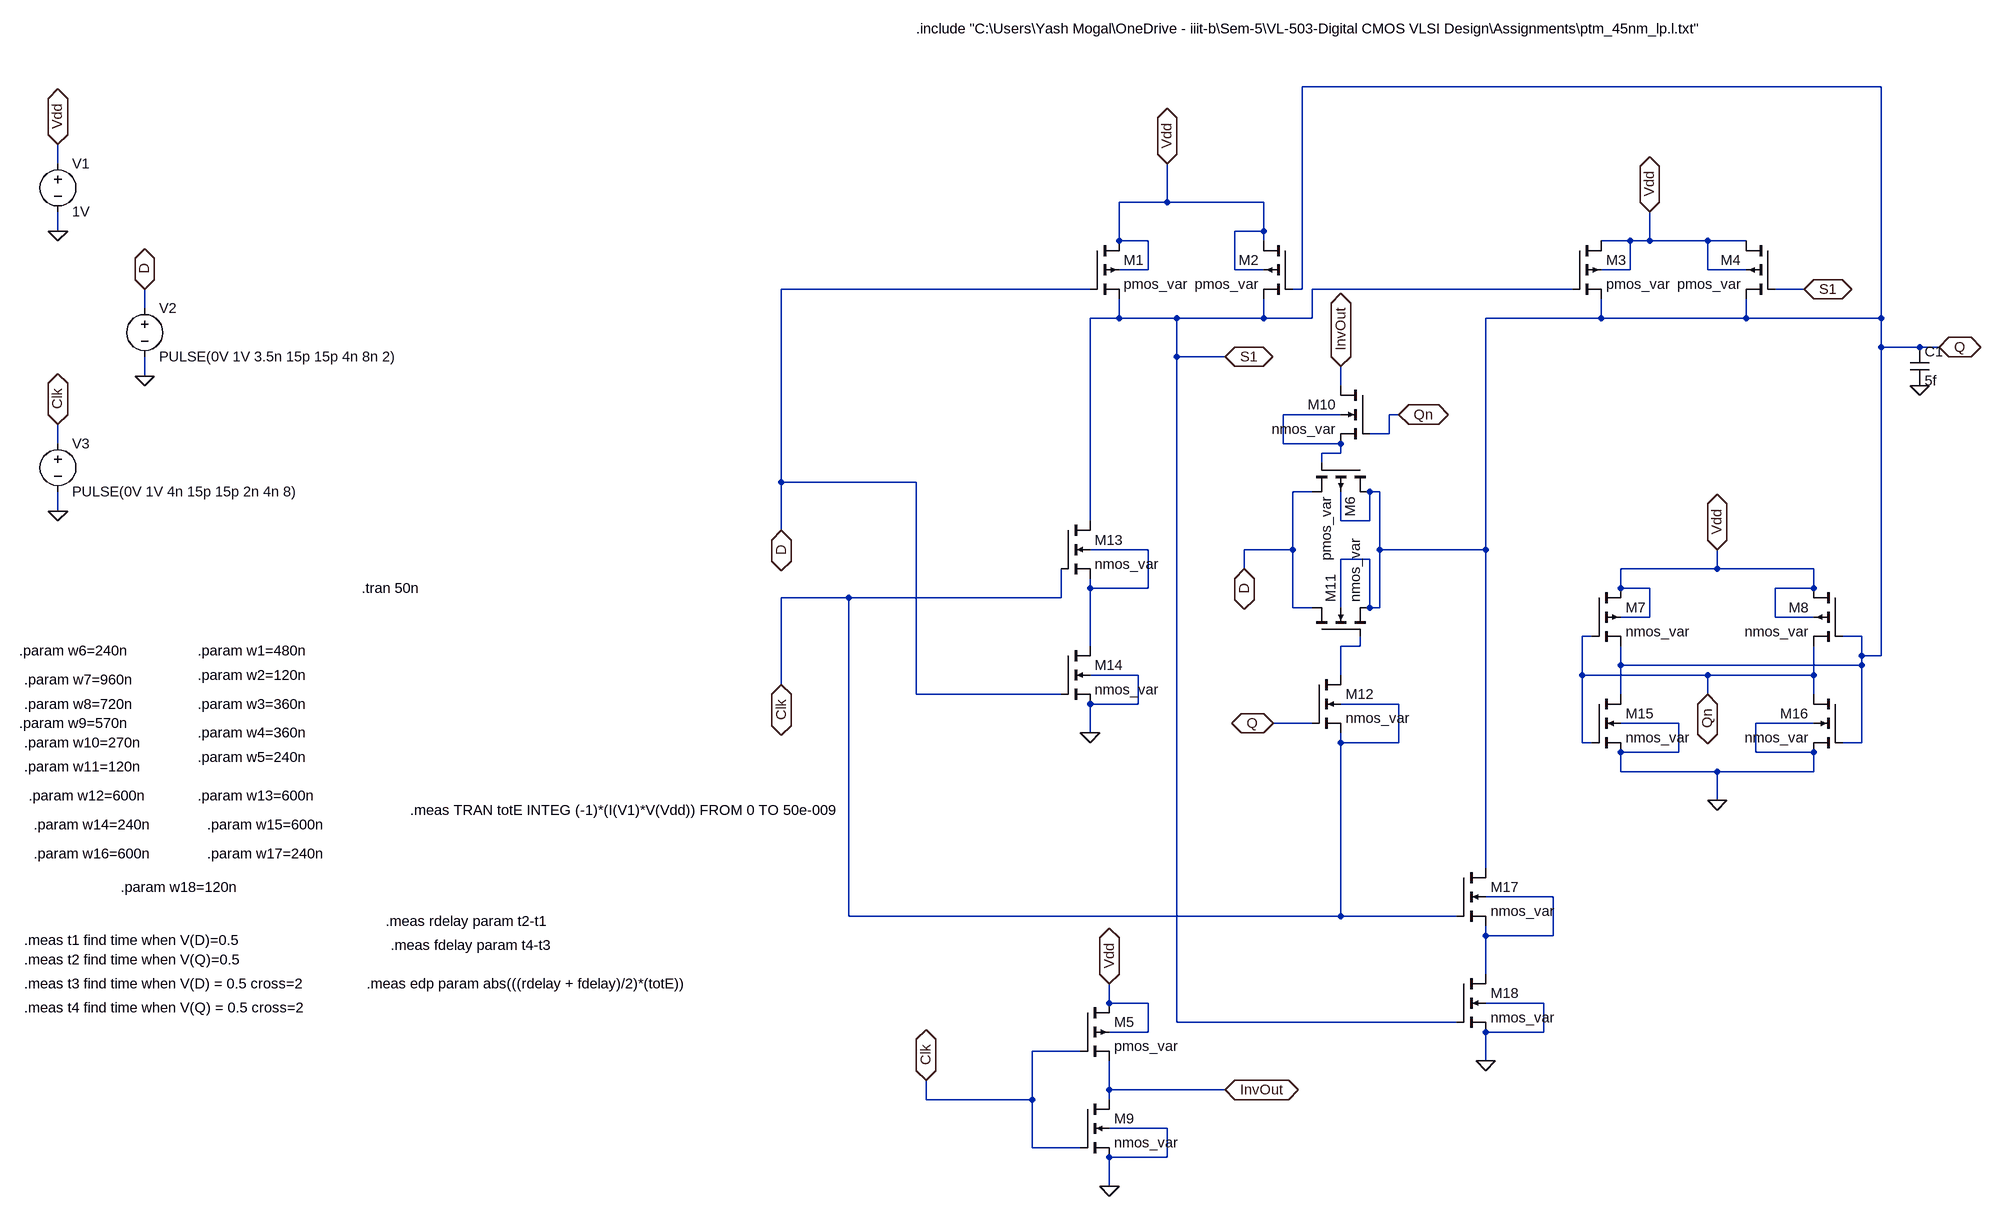
[diagram p0: schematic Proposed_ckt_new.asc]
Proposed_ckt_new.asc, the LTspice schematic file:
Version 4
SHEET 1 1552 1540
WIRE 1376 -304 416 -304
WIRE -1648 -176 -1648 -208
WIRE 192 -112 192 -176
WIRE 192 -112 112 -112
WIRE 352 -112 192 -112
WIRE -1648 -64 -1648 -96
WIRE 352 -64 352 -112
WIRE 352 -64 304 -64
WIRE 112 -48 112 -112
WIRE 160 -48 112 -48
WIRE 352 -48 352 -64
WIRE 960 -48 912 -48
WIRE 992 -48 992 -96
WIRE 992 -48 960 -48
WIRE 1088 -48 992 -48
WIRE 1152 -48 1088 -48
WIRE 160 0 160 -48
WIRE 160 0 112 0
WIRE 304 0 304 -64
WIRE 352 0 304 0
WIRE 960 0 960 -48
WIRE 960 0 912 0
WIRE 1088 0 1088 -48
WIRE 1152 0 1088 0
WIRE 64 32 -448 32
WIRE 416 32 416 -304
WIRE 416 32 400 32
WIRE 864 32 432 32
WIRE 1248 32 1200 32
WIRE -1504 64 -1504 32
WIRE 112 80 112 48
WIRE 112 80 64 80
WIRE 208 80 112 80
WIRE 352 80 352 48
WIRE 352 80 208 80
WIRE 432 80 432 32
WIRE 432 80 352 80
WIRE 912 80 912 48
WIRE 912 80 720 80
WIRE 1152 80 1152 48
WIRE 1152 80 912 80
WIRE 1376 80 1376 -304
WIRE 1376 80 1152 80
WIRE 1376 128 1376 80
WIRE 1440 128 1376 128
WIRE 1472 128 1440 128
WIRE 208 144 208 80
WIRE 288 144 208 144
WIRE -1504 176 -1504 144
WIRE 480 192 480 160
WIRE 480 240 384 240
WIRE 576 240 560 240
WIRE 560 272 560 240
WIRE 560 272 528 272
WIRE -1648 288 -1648 256
WIRE 384 288 384 240
WIRE 480 288 384 288
WIRE 480 304 480 288
WIRE 480 304 448 304
WIRE 448 320 448 304
WIRE -448 352 -448 32
WIRE -224 352 -448 352
WIRE 432 368 400 368
WIRE 544 368 528 368
WIRE -1648 400 -1648 368
WIRE 64 416 64 80
WIRE 480 416 480 368
WIRE 528 416 528 368
WIRE 528 416 480 416
WIRE -448 432 -448 352
WIRE 160 464 64 464
WIRE 400 464 400 368
WIRE 400 464 320 464
WIRE 544 464 544 368
WIRE 720 464 720 80
WIRE 720 464 544 464
WIRE 528 480 480 480
WIRE 320 496 320 464
WIRE 1104 496 1104 464
WIRE 1104 496 944 496
WIRE 1264 496 1104 496
WIRE 64 528 64 512
WIRE 160 528 160 464
WIRE 160 528 64 528
WIRE 944 528 944 496
WIRE 992 528 944 528
WIRE 1264 528 1264 496
WIRE 1264 528 1200 528
WIRE -336 544 -448 544
WIRE 16 544 16 496
WIRE 16 544 -336 544
WIRE 400 560 400 464
WIRE 432 560 400 560
WIRE 480 560 480 480
WIRE 528 560 528 480
WIRE 544 560 544 464
WIRE 544 560 528 560
WIRE 992 576 992 528
WIRE 992 576 944 576
WIRE 1200 576 1200 528
WIRE 1264 576 1200 576
WIRE 896 608 880 608
WIRE 1344 608 1312 608
WIRE 64 624 64 528
WIRE 512 624 512 608
WIRE 512 624 480 624
WIRE 1344 640 1344 608
WIRE 1376 640 1376 128
WIRE 1376 640 1344 640
WIRE 944 656 944 624
WIRE 1344 656 1344 640
WIRE 1344 656 944 656
WIRE 144 672 64 672
WIRE 480 672 480 624
WIRE 880 672 880 608
WIRE 1088 672 880 672
WIRE 1264 672 1264 624
WIRE 1264 672 1088 672
WIRE -448 688 -448 544
WIRE -224 704 -224 352
WIRE 16 704 -224 704
WIRE 944 704 944 656
WIRE 1088 704 1088 672
WIRE 1264 704 1264 672
WIRE 144 720 144 672
WIRE 144 720 64 720
WIRE 576 720 480 720
WIRE 432 752 368 752
WIRE 1040 752 944 752
WIRE 1264 752 1168 752
WIRE 64 768 64 720
WIRE 480 784 480 768
WIRE 576 784 576 720
WIRE 576 784 480 784
WIRE 880 784 880 672
WIRE 896 784 880 784
WIRE 1344 784 1344 656
WIRE 1344 784 1312 784
WIRE 1040 800 1040 752
WIRE 1040 800 944 800
WIRE 1168 800 1168 752
WIRE 1264 800 1168 800
WIRE 944 832 944 800
WIRE 1104 832 944 832
WIRE 1264 832 1264 800
WIRE 1264 832 1104 832
WIRE 1104 880 1104 832
WIRE 720 992 720 464
WIRE 832 1040 720 1040
WIRE -336 1072 -336 544
WIRE 480 1072 480 784
WIRE 480 1072 -336 1072
WIRE 672 1072 480 1072
WIRE 720 1104 720 1088
WIRE 832 1104 832 1040
WIRE 832 1104 720 1104
WIRE 720 1168 720 1104
WIRE 96 1216 96 1184
WIRE 160 1216 96 1216
WIRE 816 1216 720 1216
WIRE 208 1248 208 144
WIRE 672 1248 208 1248
WIRE 160 1264 160 1216
WIRE 160 1264 96 1264
WIRE 816 1264 816 1216
WIRE 816 1264 720 1264
WIRE 48 1296 -32 1296
WIRE 720 1312 720 1264
WIRE 96 1360 96 1312
WIRE 288 1360 96 1360
WIRE -208 1376 -208 1344
WIRE -32 1376 -32 1296
WIRE -32 1376 -208 1376
WIRE 96 1376 96 1360
WIRE 192 1424 96 1424
WIRE -32 1456 -32 1376
WIRE 48 1456 -32 1456
WIRE 192 1472 192 1424
WIRE 192 1472 96 1472
WIRE 96 1520 96 1472
FLAG 288 1360 InvOut
IOPIN 288 1360 BiDir
FLAG 96 1520 0
FLAG 720 1312 0
FLAG 64 768 0
FLAG 1104 880 0
FLAG -208 1344 Clk
IOPIN -208 1344 BiDir
FLAG -448 688 Clk
IOPIN -448 688 BiDir
FLAG -448 432 D
IOPIN -448 432 BiDir
FLAG 192 -176 Vdd
IOPIN 192 -176 BiDir
FLAG 992 -96 Vdd
IOPIN 992 -96 BiDir
FLAG 480 160 InvOut
IOPIN 480 160 BiDir
FLAG 576 240 Qn
IOPIN 576 240 BiDir
FLAG 320 496 D
IOPIN 320 496 BiDir
FLAG 1472 128 Q
IOPIN 1472 128 BiDir
FLAG 96 1184 Vdd
IOPIN 96 1184 BiDir
FLAG 368 752 Q
IOPIN 368 752 BiDir
FLAG 1248 32 S1
IOPIN 1248 32 BiDir
FLAG 1104 464 Vdd
IOPIN 1104 464 BiDir
FLAG -1648 -64 0
FLAG -1504 176 0
FLAG -1648 400 0
FLAG -1648 -208 Vdd
IOPIN -1648 -208 BiDir
FLAG -1504 32 D
IOPIN -1504 32 BiDir
FLAG -1648 256 Clk
IOPIN -1648 256 BiDir
FLAG 1088 704 Qn
IOPIN 1088 704 BiDir
FLAG 1440 192 0
FLAG 288 144 S1
IOPIN 288 144 BiDir
SYMBOL pmos4 64 -48 R0
SYMATTR InstName M1
SYMATTR Value pmos_var
SYMATTR Value2 l=45nm w=w1
SYMBOL pmos4 400 -48 M0
SYMATTR InstName M2
SYMATTR Value pmos_var
SYMATTR Value2 l=45nm w=w2
SYMBOL pmos4 864 -48 R0
SYMATTR InstName M3
SYMATTR Value pmos_var
SYMATTR Value2 l=45nm w=w3
SYMBOL pmos4 1200 -48 M0
SYMATTR InstName M4
SYMATTR Value pmos_var
SYMATTR Value2 l=45nm w=w4
SYMBOL pmos4 48 1216 R0
SYMATTR InstName M5
SYMATTR Value pmos_var
SYMATTR Value2 l=45nm w=w17
SYMBOL pmos4 528 320 R90
SYMATTR InstName M6
SYMATTR Value pmos_var
SYMATTR Value2 l=45nm w=w6
SYMBOL pmos4 896 528 R0
SYMATTR InstName M7
SYMATTR Value nmos_var
SYMATTR Value2 l=45nm w=w8
SYMBOL pmos4 1312 528 M0
SYMATTR InstName M8
SYMATTR Value nmos_var
SYMATTR Value2 l=45nm w=w9
SYMBOL nmos4 48 1376 R0
SYMATTR InstName M9
SYMATTR Value nmos_var
SYMATTR Value2 l=45nm w=w18
SYMBOL nmos4 528 192 M0
SYMATTR InstName M10
SYMATTR Value nmos_var
SYMATTR Value2 l=45nm w=w5
SYMBOL nmos4 432 608 R270
SYMATTR InstName M11
SYMATTR Value nmos_var
SYMATTR Value2 l=45nm w=w7
SYMBOL nmos4 432 672 R0
SYMATTR InstName M12
SYMATTR Value nmos_var
SYMATTR Value2 l=45nm w=w14
SYMBOL nmos4 16 416 R0
SYMATTR InstName M13
SYMATTR Value nmos_var
SYMATTR Value2 l=45nm w=w12
SYMBOL nmos4 16 624 R0
SYMATTR InstName M14
SYMATTR Value nmos_var
SYMATTR Value2 l=45nm w=w13
SYMBOL nmos4 896 704 R0
SYMATTR InstName M15
SYMATTR Value nmos_var
SYMATTR Value2 l=45nm w=w10
SYMBOL nmos4 1312 704 M0
SYMATTR InstName M16
SYMATTR Value nmos_var
SYMATTR Value2 l=45nm w=w11
SYMBOL nmos4 672 992 R0
SYMATTR InstName M17
SYMATTR Value nmos_var
SYMATTR Value2 l=45nm w=w15
SYMBOL nmos4 672 1168 R0
SYMATTR InstName M18
SYMATTR Value nmos_var
SYMATTR Value2 l=45nm w=w16
SYMBOL voltage -1648 -192 R0
WINDOW 123 0 0 Left 0
WINDOW 39 0 0 Left 0
SYMATTR InstName V1
SYMATTR Value 1V
SYMBOL voltage -1504 48 R0
WINDOW 123 0 0 Left 0
WINDOW 39 0 0 Left 0
SYMATTR InstName V2
SYMATTR Value PULSE(0V 1V 3.5n 15p 15p 4n 8n 2)
SYMBOL voltage -1648 272 R0
WINDOW 123 0 0 Left 0
WINDOW 39 0 0 Left 0
SYMATTR InstName V3
SYMATTR Value PULSE(0V 1V 4n 15p 15p 2n 4n 8)
SYMBOL cap 1424 128 R0
SYMATTR InstName C1
SYMATTR Value 5f
TEXT -224 -400 Left 2 !.include "C:\\Users\\Yash Mogal\\OneDrive - iiit-b\\Sem-5\\VL-503-Digital CMOS VLSI Design\\Assignments\\ptm_45nm_lp.l.txt"
TEXT -1416 632 Left 2 !.param w1=480n
TEXT -1416 672 Left 2 !.param w2=120n
TEXT -1416 720 Left 2 !.param w3=360n
TEXT -1416 768 Left 2 !.param w4=360n
TEXT -1416 808 Left 2 !.param w5=240n
TEXT -1712 632 Left 2 !.param w6=240n
TEXT -1704 680 Left 2 !.param w7=960n
TEXT -1704 720 Left 2 !.param w8=720n
TEXT -1712 752 Left 2 !.param w9=570n
TEXT -1704 784 Left 2 !.param w10=270n
TEXT -1704 824 Left 2 !.param w11=120n
TEXT -1696 872 Left 2 !.param w12=600n
TEXT -1416 872 Left 2 !.param w13=600n
TEXT -1688 920 Left 2 !.param w14=240n
TEXT -1400 920 Left 2 !.param w15=600n
TEXT -1688 968 Left 2 !.param w16=600n
TEXT -1400 968 Left 2 !.param w17=240n
TEXT -1544 1024 Left 2 !.param w18=120n
TEXT -1704 1112 Left 2 !.meas t1 find time when V(D)=0.5
TEXT -1704 1144 Left 2 !.meas t2 find time when V(Q)=0.5
TEXT -1704 1184 Left 2 !.meas t3 find time when V(D) = 0.5 cross=2
TEXT -1704 1224 Left 2 !.meas t4 find time when V(Q) = 0.5 cross=2
TEXT -1104 1080 Left 2 !.meas rdelay param t2-t1
TEXT -1096 1120 Left 2 !.meas fdelay param t4-t3
TEXT -1136 1184 Left 2 !.meas edp param abs(((rdelay + fdelay)/2)*(totE))
TEXT -1144 528 Left 2 !.tran 50n
TEXT -1064 896 Left 2 !.meas TRAN totE INTEG (-1)*(I(V1)*V(Vdd)) FROM 0 TO 50e-009

The netlist it stands for:
* Proposed_ckt_new.asc
M1 Vdd D S1 Vdd pmos_var l=45nm w=w1
M2 Vdd Q S1 Vdd pmos_var l=45nm w=w2
M3 Vdd S1 Q Vdd pmos_var l=45nm w=w3
M4 Vdd S1 Q Vdd pmos_var l=45nm w=w4
M5 Vdd Clk InvOut Vdd pmos_var l=45nm w=w17
M6 Q N001 D Q pmos_var l=45nm w=w6
M7 Vdd Qn Q Vdd nmos_var l=45nm w=w8
M8 Vdd Q Qn Vdd nmos_var l=45nm w=w9
M9 InvOut Clk 0 0 nmos_var l=45nm w=w18
M10 InvOut Qn N001 N001 nmos_var l=45nm w=w5
M11 D N003 Q Q nmos_var l=45nm w=w7
M12 N003 Q Clk Clk nmos_var l=45nm w=w14
M13 S1 Clk N002 N002 nmos_var l=45nm w=w12
M14 N002 D 0 0 nmos_var l=45nm w=w13
M15 Q Qn 0 0 nmos_var l=45nm w=w10
M16 Qn Q 0 0 nmos_var l=45nm w=w11
M17 Q Clk N004 N004 nmos_var l=45nm w=w15
M18 N004 S1 0 0 nmos_var l=45nm w=w16
V1 Vdd 0 1V
V2 D 0 PULSE(0V 1V 3.5n 15p 15p 4n 8n 2)
V3 Clk 0 PULSE(0V 1V 4n 15p 15p 2n 4n 8)
C1 Q 0 5f
.model NMOS NMOS
.model PMOS PMOS
.lib standard.mos
.include "C:\Users\Yash Mogal\OneDrive - iiit-b\Sem-5\VL-503-Digital CMOS VLSI Design\Assignments\ptm_45nm_lp.l.txt"
.param w1=480n
.param w2=120n
.param w3=360n
.param w4=360n
.param w5=240n
.param w6=240n
.param w7=960n
.param w8=720n
.param w9=570n
.param w10=270n
.param w11=120n
.param w12=600n
.param w13=600n
.param w14=240n
.param w15=600n
.param w16=600n
.param w17=240n
.param w18=120n
.meas t1 find time when V(D)=0.5
.meas t2 find time when V(Q)=0.5
.meas t3 find time when V(D) = 0.5 cross=2
.meas t4 find time when V(Q) = 0.5 cross=2
.meas rdelay param t2-t1
.meas fdelay param t4-t3
.meas edp param abs(((rdelay + fdelay)/2)*(totE))
.tran 50n
.meas TRAN totE INTEG (-1)*(I(V1)*V(Vdd)) FROM 0 TO 50e-009
.backanno
.end